# Altium schematic sheet [07]CELLULAR.SchDoc
size B
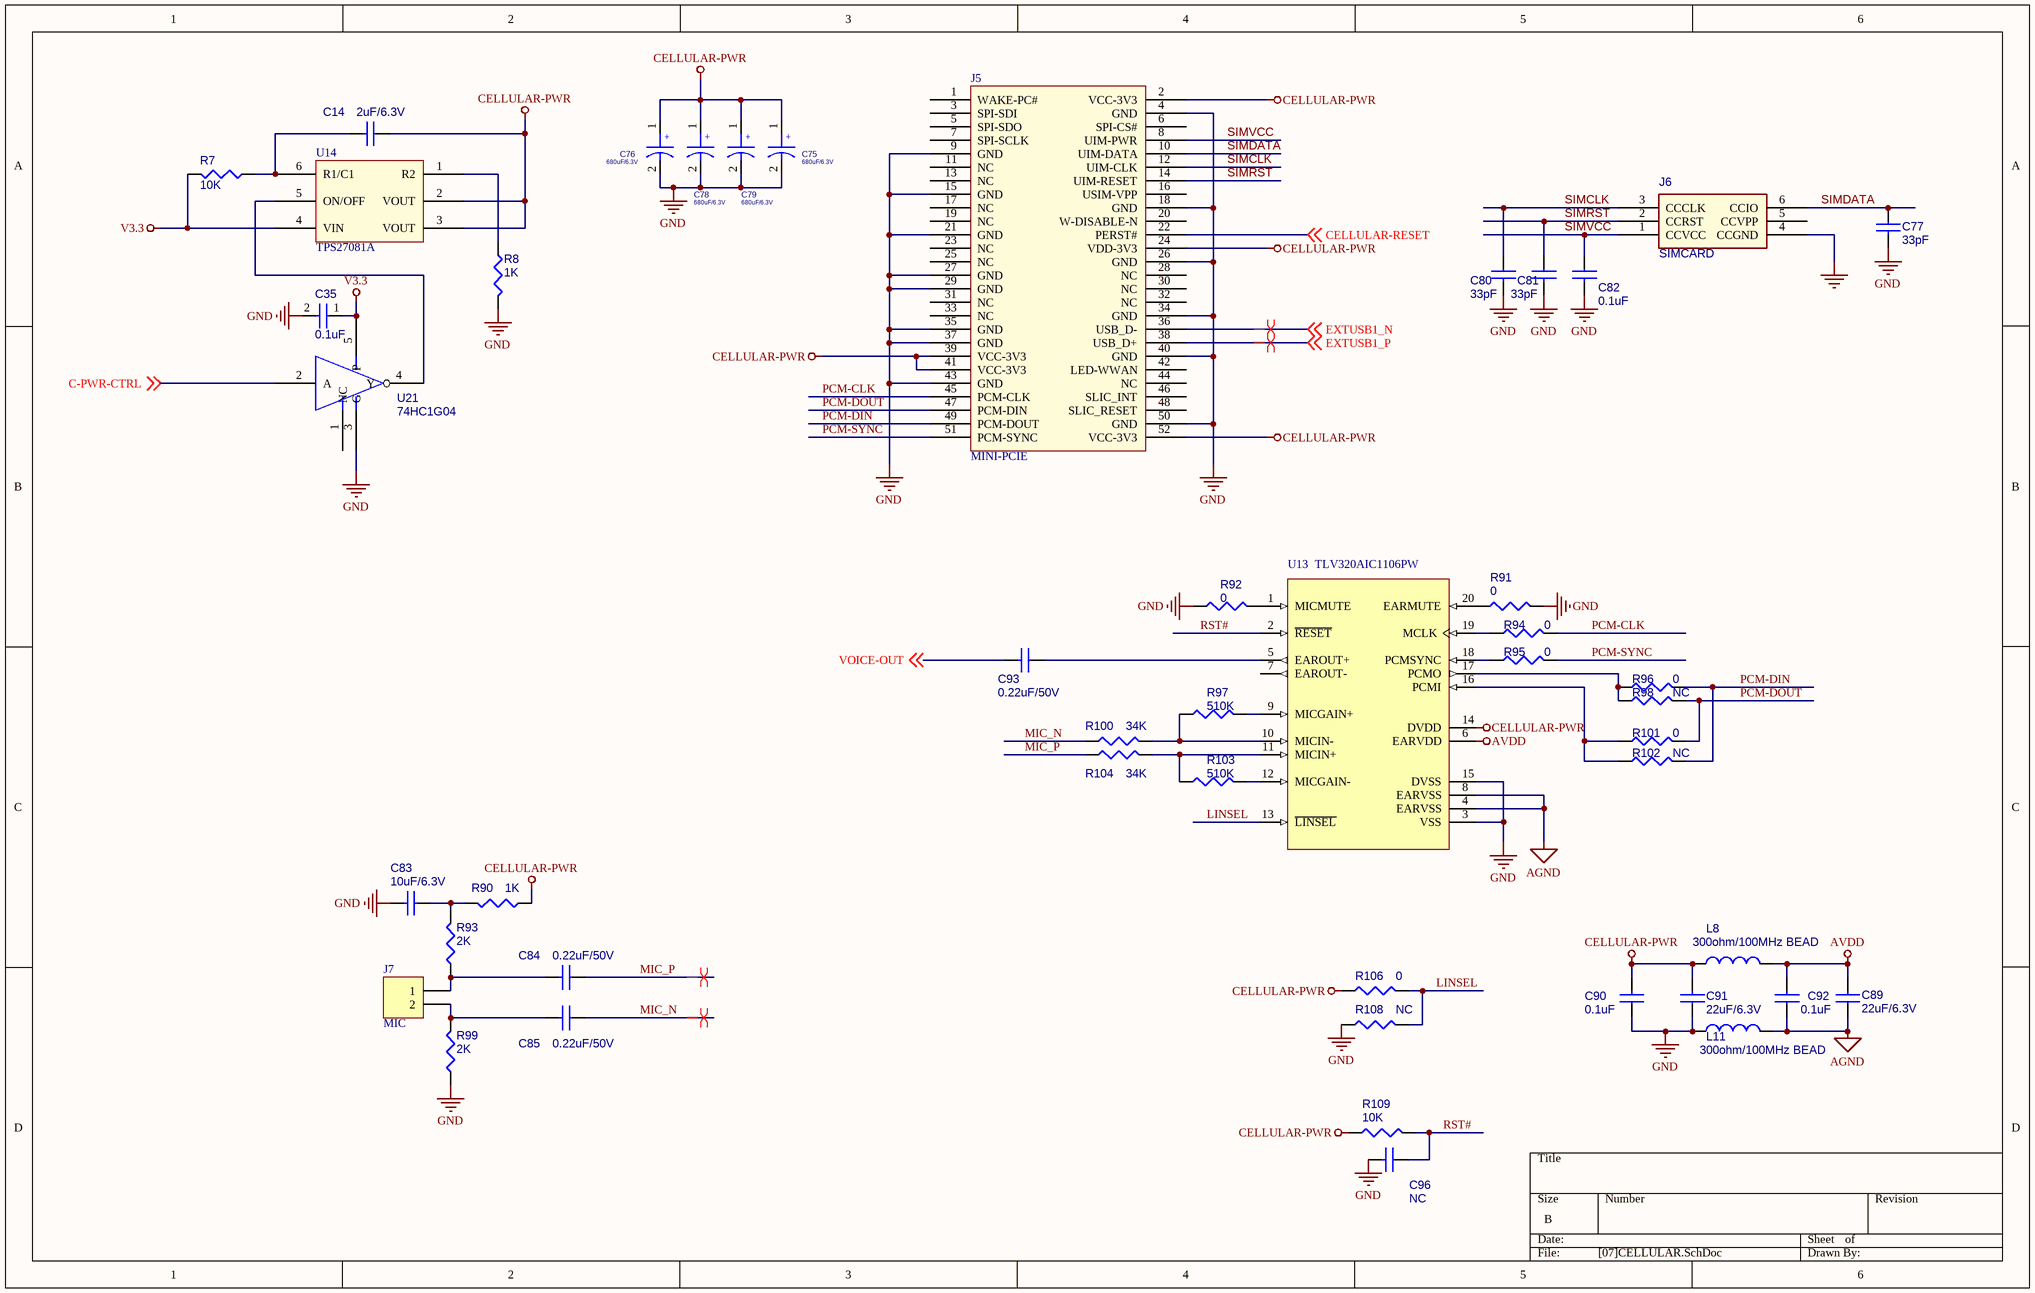
[diagram p0: [07]CELLULAR.SchDoc]

## Parts
C14  2uF/6.3V  [0603]
C35  0.1uF  [0603]
C75  680uF/6.3V  [7343]
C76  680uF/6.3V  [7343]
C77  33pF  [0603]
C78  680uF/6.3V  [7343]
C79  680uF/6.3V  [7343]
C80  33pF  [0603]
C81  33pF  [0603]
C82  0.1uF  [0603]
C83  10uF/6.3V  [0805]
C84  0.22uF/50V  [0603]
C85  0.22uF/50V  [0603]
C89  22uF/6.3V  [0805]
C90  0.1uF  [0603]
C91  22uF/6.3V  [0805]
C92  0.1uF  [0603]
C93  0.22uF/50V  [0603]
C96  NC  [0603]
J5  MINI-PCIE  [MINI-PCIE]
J6  SIMCARD  [SIMLOCK2]
J7  MIC  [CON-2PIN]
L8  300ohm/100MHz BEAD  [0603]
L11  300ohm/100MHz BEAD  [0603]
R7  10K  [0603]
R8  1K  [0603]
R90  1K  [0603]
R91  0  [0603]
R92  0  [0603]
R93  2K  [0603]
R94  0  [0603]
R95  0  [0603]
R96  0  [0603]
R97  510K  [0603]
R98  NC  [0603]
R99  2K  [0603]
R100  34K  [0603]
R101  0  [0603]
R102  NC  [0603]
R103  510K  [0603]
R104  34K  [0603]
R106  0  [0603]
R108  NC  [0603]
R109  10K  [0603]
U13  TLV320AIC1106PW  [PW020]
U14  TPS27081A  [SOT23-6]
U21  74HC1G04  [SOT753]

## Nets
AGND: C89.1 C92.1 L11.1 U13.4(EARVSS) U13.8(EARVSS)
AVDD: C89.2 C92.2 L8.1 U13.6(EARVDD)
CELLULAR-PWR: C14.1 C75.1 C76.1 C78.1 C79.1 C90.2 C91.2 J5.2(VCC-3V3) J5.24(VDD-3V3) J5.39(VCC-3V3) J5.41(VCC-3V3) J5.52(VCC-3V3) L8.2 R90.2 R106.2 R109.2 U13.14(DVDD) U14.2(VOUT) U14.3(VOUT)
GND: C35.2 C75.2 C76.2 C77.2 C78.2 C79.2 C80.2 C81.2 C82.2 C83.2 C90.1 C91.1 C96.2 J5.4(GND) J5.9(GND) J5.15(GND) J5.18(GND) J5.21(GND) J5.26(GND) J5.27(GND) J5.29(GND) J5.34(GND) J5.35(GND) J5.37(GND) J5.40(GND) J5.43(GND) J5.50(GND) J6.4(CCGND) L11.2 R8.1 R91.1 R92.2 R99.2 R108.2 U13.3(VSS) U13.15(DVSS) U21.3(G)
V3.3: C35.1 R7.1 U14.4(VIN) U21.5(P)
C-PWR-CTRL: U21.2(A) ; off-sheet C-PWR-CTRL
CELLULAR-RESET: J5.22(PERST#) ; off-sheet CELLULAR-RESET
EXTUSB1_N: J5.36(USB_D-) ; off-sheet EXTUSB1_N
EXTUSB1_P: J5.38(USB_D+) ; off-sheet EXTUSB1_P
LINSEL: R106.1 R108.1 U13.13(~{LINSEL})
MIC_N: C85.1 R100.2
MIC_P: C84.1 R104.2
PCM-CLK: J5.45(PCM-CLK) R94.1
PCM-DIN: J5.49(PCM-DOUT) R96.1 R102.1
PCM-DOUT: J5.47(PCM-DIN) R98.1 R101.1
PCM-SYNC: J5.51(PCM-SYNC) R95.1
RST#: C96.1 R109.1 U13.2(~{RESET})
SIMCLK: C80.1 J5.12(UIM-CLK) J6.3(CCCLK)
SIMDATA: C77.1 J5.10(UIM-DATA) J6.6(CCIO)
SIMRST: C81.1 J5.14(UIM-RESET) J6.2(CCRST)
SIMVCC: C82.1 J5.8(UIM-PWR) J6.1(CCVCC)
VOICE-OUT: C93.2 ; off-sheet VOICE-OUT
NetC14_2: C14.2 R7.2 U14.6(R1/C1)
NetC83_1: C83.1 R90.1 R93.1
NetC84_2: C84.2 J7.1 R93.2
NetC85_2: C85.2 J7.2 R99.1
NetC93_1: C93.1 U13.5(EAROUT+)
NetR8_2: R8.2 U14.1(R2)
NetR91_2: R91.2 U13.20(EARMUTE)
NetR92_1: R92.1 U13.1(MICMUTE)
NetR94_2: R94.2 U13.19(MCLK)
NetR95_2: R95.2 U13.18(PCMSYNC)
NetR96_2: R96.2 R98.2 U13.17(PCMO)
NetR97_1: R97.1 U13.9(MICGAIN+)
NetR97_2: R97.2 R100.1 U13.10(MICIN-)
NetR101_2: R101.2 R102.2 U13.16(PCMI)
NetR103_1: R103.1 U13.12(MICGAIN-)
NetR103_2: R103.2 R104.1 U13.11(MICIN+)
NetU14_5: U14.5(ON/OFF) U21.4(Y)

Not connected (* = marked no-connect by the designer): J5 1(WAKE-PC#) 3(SPI-SDI) 5(SPI-SDO) 6(SPI-CS#) 7(SPI-SCLK) 11(NC) 13(NC) 16(USIM-VPP) 17(NC) 19(NC) 20(W-DISABLE-N) 23(NC) 25(NC) 28(NC) 30(NC) 31(NC) 32(NC) 33(NC) 42(LED-WWAN) 44(NC) 46(SLIC_INT) 48(SLIC_RESET); J6 5(CCVPP); U13 7(EAROUT-); U21 1(NC)

## Layout directives
differential pair: EXTUSB1_N, EXTUSB1_P, MIC_N, MIC_P

## Notes on the sheet
- (in symbol 10U-6032-20V) +

## Library data of the parts
C14 C77 C80-C85 C89-C93 C96 = P_CAP NP
C35 = CAP NP_Dup2
C75 C76 C78 C79 = 10U-6032-20V: CAP;10U  ,TT,20V ,20%,6032,SMT
J7 = Header 2: Header, 2-Pin; LatestRevisionDate: 17-Jul-2002; LatestRevisionNote: Re-released for DXP Platform.; Publisher: Altium Limited
L8 L11 = INDUCTOR_4
R7 R8 R90-R104 R106 R108 R109 = P_R
U13 = TLV320AIC1106PWG4: PCM CODEC With Microphone Amps & Speaker Driver, 20-Pin TSSOP; Published: 16-Dec-2005; DatasheetVersion: 13-Sep-2005; PackageVersion: Feb-1999; PackageReference: PW020; Publisher: Altium Limited; PackageDescription: Shrink Small Outline; 20 Leads; Body Width 4.4 mm; Pitch 0.65 mm; ComponentLink1Description: Manufacturer Link; ComponentLink1URL: http://www.ti.com/; ComponentLink2Description: Datasheet; ComponentLink2URL: http://focus.ti.com/lit/ds/symlink/tlv320aic1106.pdf
U21 = 74LVC1G04GW_SOT353-5: Part  Number: SA00000FX00